# EAGLE schematic class_nrf52840v2_module (EAGLE 9.4.2)
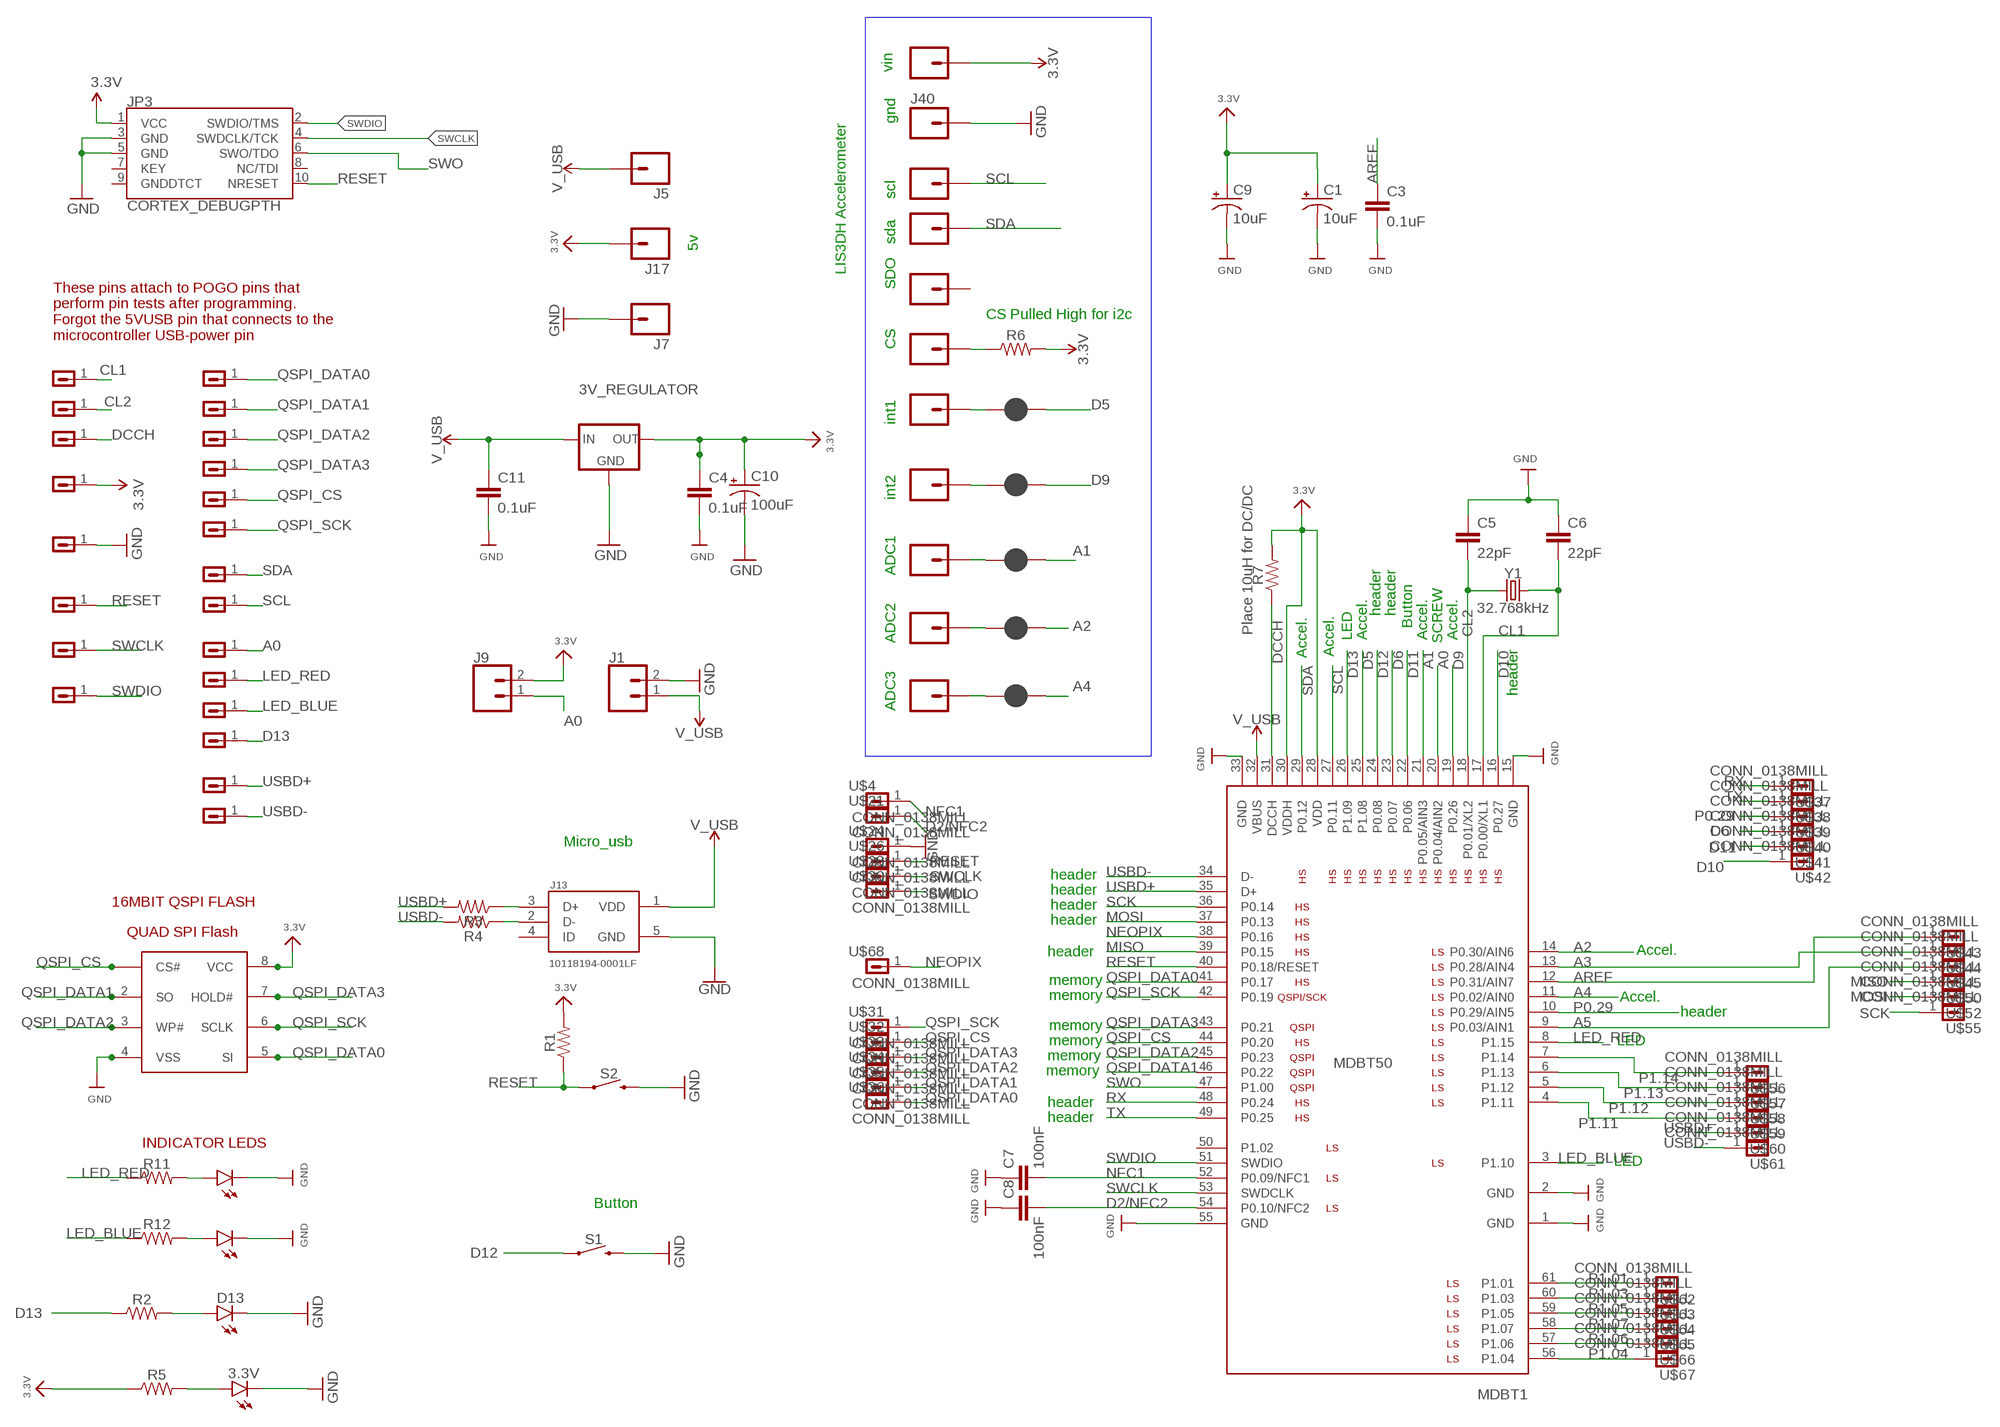
[diagram p0: schematic, sheet 1]

## Parts
3.3V  LED5MM-KIT  [LED5MM-KIT]
3V_REGULATOR  LDL1117_5V_REG  [SOT223]
C1  10uF  10UF-POLAR-RADIAL-2.5MM-KIT-25V-20%  [CPOL-RADIAL-2.5MM-5MM-KIT]
C3  0.1uF  0.1UF-KIT-EZ-50V-20%  [CAP-PTH-SMALL-KIT]
C4  0.1uF  0.1UF-KIT-EZ-50V-20%  [CAP-PTH-SMALL-KIT]
C5  22pF  0.1UF-KIT-EZ-50V-20%  [CAP-PTH-SMALL-KIT]
C6  22pF  0.1UF-KIT-EZ-50V-20%  [CAP-PTH-SMALL-KIT]
C7  100nF  10UF-0805-10V-10%  [0805]
C8  100nF  10UF-0805-10V-10%  [0805]
C9  10uF  10UF-POLAR-RADIAL-2.5MM-KIT-25V-20%  [CPOL-RADIAL-2.5MM-5MM-KIT]
C10  100uF  100UF-POLAR-RADIAL-2.5MM-25V-20%  [CPOL-RADIAL-2.5MM-6.5MM]
C11  0.1uF  0.1UF-KIT-EZ-50V-20%  [CAP-PTH-SMALL-KIT]
D2  LED5MM-KIT  [LED5MM-KIT]
D3  LED5MM-KIT  [LED5MM-KIT]
D13  LED5MM-KIT  [LED5MM-KIT]
J1  CONN_025MM  [SCREWTERMINAL-5MM-2]
J5  M01PTH  [1X01]
J7  M01PTH  [1X01]
J9  CONN_025MM  [SCREWTERMINAL-5MM-2]
J13  10118194-0001LF  [FRAMATOME_10118194-0001LF]
J17  M01PTH  [1X01]
J22  M01PTH  [1X01]
J23  M01PTH  [1X01]
J24  M01PTH  [1X01]
J25  M01PTH  [1X01]
J26  M01PTH  [1X01]
J27  M01PTH  [1X01]
J39  M01PTH  [1X01]
J40  M01PTH  [1X01]
J42  M01PTH  [1X01]
J43  M01PTH  [1X01]
J44  M01PTH  [1X01]
JP1  JUMPER-SMT_2_NC_PASTE_SILK  [SMT-JUMPER_2_NC_PASTE_SILK]
JP2  JUMPER-SMT_2_NC_PASTE_SILK  [SMT-JUMPER_2_NC_PASTE_SILK]
JP3  CORTEX_DEBUGPTH  [2X5-PTH-1.27MM]
JP4  JUMPER-SMT_2_NC_PASTE_SILK  [SMT-JUMPER_2_NC_PASTE_SILK]
JP6  JUMPER-SMT_2_NC_PASTE_SILK  [SMT-JUMPER_2_NC_PASTE_SILK]
JP7  JUMPER-SMT_2_NC_PASTE_SILK  [SMT-JUMPER_2_NC_PASTE_SILK]
MDBT1  MDBT50  [MDBT50]
R1  RESISTORAXIAL-0.3  [AXIAL-0.3]
R2  RESISTORAXIAL-0.3  [AXIAL-0.3]
R3  RESISTORAXIAL-0.3  [AXIAL-0.3]
R4  RESISTORAXIAL-0.3  [AXIAL-0.3]
R5  RESISTORAXIAL-0.3  [AXIAL-0.3]
R6  RESISTORAXIAL-0.3  [AXIAL-0.3]
R7  RESISTORAXIAL-0.3  [AXIAL-0.3]
R11  RESISTORAXIAL-0.3  [AXIAL-0.3]
R12  RESISTORAXIAL-0.3  [AXIAL-0.3]
S1  MOMENTARY-SWITCH-SPST-PTH-12MM  [TACTILE_SWITCH_PTH_12MM]
S2  MOMENTARY-SWITCH-SPST-PTH-12MM  [TACTILE_SWITCH_PTH_12MM]
U$4  CONN_0138MILL  [1X01-40MILL]
U$13  CONN_011.27MM  [1X01-1.27MM]
U$18  CONN_011.27MM  [1X01-1.27MM]
U$19  CONN_011.27MM  [1X01-1.27MM]
U$20  CONN_011.27MM  [1X01-1.27MM]
U$21  CONN_0138MILL  [1X01-40MILL]
U$22  CONN_011.27MM  [1X01-1.27MM]
U$23  CONN_011.27MM  [1X01-1.27MM]
U$24  CONN_0138MILL  [1X01-40MILL]
U$26  CONN_0138MILL  [1X01-40MILL]
U$28  CONN_0138MILL  [1X01-40MILL]
U$29  QUAD_SPI_FLASHSOIC8_300MIL  [SOIC8]
U$30  CONN_0138MILL  [1X01-40MILL]
U$31  CONN_0138MILL  [1X01-40MILL]
U$32  CONN_0138MILL  [1X01-40MILL]
U$33  CONN_0138MILL  [1X01-40MILL]
U$34  CONN_0138MILL  [1X01-40MILL]
U$35  CONN_0138MILL  [1X01-40MILL]
U$36  CONN_0138MILL  [1X01-40MILL]
U$37  CONN_0138MILL  [1X01-40MILL]
U$38  CONN_0138MILL  [1X01-40MILL]
U$39  CONN_0138MILL  [1X01-40MILL]
U$40  CONN_0138MILL  [1X01-40MILL]
U$41  CONN_0138MILL  [1X01-40MILL]
U$42  CONN_0138MILL  [1X01-40MILL]
U$43  CONN_0138MILL  [1X01-40MILL]
U$44  CONN_0138MILL  [1X01-40MILL]
U$45  CONN_0138MILL  [1X01-40MILL]
U$50  CONN_0138MILL  [1X01-40MILL]
U$52  CONN_0138MILL  [1X01-40MILL]
U$55  CONN_0138MILL  [1X01-40MILL]
U$56  CONN_0138MILL  [1X01-40MILL]
U$57  CONN_0138MILL  [1X01-40MILL]
U$58  CONN_0138MILL  [1X01-40MILL]
U$59  CONN_0138MILL  [1X01-40MILL]
U$60  CONN_0138MILL  [1X01-40MILL]
U$61  CONN_0138MILL  [1X01-40MILL]
U$62  CONN_0138MILL  [1X01-40MILL]
U$63  CONN_0138MILL  [1X01-40MILL]
U$64  CONN_0138MILL  [1X01-40MILL]
U$65  CONN_0138MILL  [1X01-40MILL]
U$66  CONN_0138MILL  [1X01-40MILL]
U$67  CONN_0138MILL  [1X01-40MILL]
U$68  CONN_0138MILL  [1X01-40MILL]
U$69  CONN_011.27MM  [1X01-1.27MM]
U$70  CONN_011.27MM  [1X01-1.27MM]
U$71  CONN_011.27MM  [1X01-1.27MM]
U$72  CONN_011.27MM  [1X01-1.27MM]
U$73  CONN_011.27MM  [1X01-1.27MM]
U$74  CONN_011.27MM  [1X01-1.27MM]
U$75  CONN_011.27MM  [1X01-1.27MM]
U$76  CONN_011.27MM  [1X01-1.27MM]
U$77  CONN_011.27MM  [1X01-1.27MM]
U$78  CONN_011.27MM  [1X01-1.27MM]
U$79  CONN_011.27MM  [1X01-1.27MM]
U$80  CONN_011.27MM  [1X01-1.27MM]
U$81  CONN_011.27MM  [1X01-1.27MM]
U$82  CONN_011.27MM  [1X01-1.27MM]
U$83  CONN_011.27MM  [1X01-1.27MM]
U$84  CONN_011.27MM  [1X01-1.27MM]
Y1  32.768kHz  CRYSTAL-32.768KHZPTH-2X6  [CRYSTAL-PTH-2X6-CYL]

## Nets
3.3V [power]: 3V_REGULATOR.2(OUT) 3V_REGULATOR.4(OUT) C1.1(+) C4.1 C9.1(+) C10.1(+) J9.2 J17.1 J22.1 JP3.1(VCC) MDBT1.28(VDD) MDBT1.30(VDDH) R1.P$2 R5.P$1 R6.P$2 R7.P$2 U$18.1 U$29.8(VCC)
A0: J9.1 MDBT1.20(P0.04/AIN2) U$76.1
A1: JP4.2 MDBT1.21(P0.05/AIN3)
A2: JP6.2 MDBT1.14(P0.30/AIN6)
A3: MDBT1.13(P0.28/AIN4) U$44.1
A4: JP7.2 MDBT1.11(P0.02/AIN0)
A5: MDBT1.9(P0.03/AIN1) U$45.1
AREF: C3.1 MDBT1.12(P0.31/AIN7) U$43.1
CL1: C6.2 MDBT1.17(P0.00/XL1) U$82.1 Y1.2
CL2: C5.2 MDBT1.18(P0.01/XL2) U$83.1 Y1.1
D2/NFC2: C8.2 MDBT1.54(P0.10/NFC2) U$21.1
D5: JP1.2 MDBT1.25(P1.08)
D6: MDBT1.23(P0.07) U$40.1
D9: JP2.2 MDBT1.19(P0.26)
D10: MDBT1.16(P0.27) U$42.1
D11: MDBT1.22(P0.06) U$41.1
D12: MDBT1.24(P0.08) S1.1
D13: MDBT1.26(P1.09) R2.P$1 U$79.1
DCCH: MDBT1.31(DCCH) R7.P$1 U$84.1
GND: 3.3V.K(C) 3V_REGULATOR.1(GND) C1.2(-) C3.2 C4.2 C5.1 C6.1 C7.1 C8.1 C9.2(-) C10.2(-) C11.2 D2.K(C) D3.K(C) D13.K(C) J1.2 J7.1 J13.5(GND) J40.1 JP3.3(GND) JP3.5(GND) MDBT1.1(GND) MDBT1.2(GND) MDBT1.15(GND) MDBT1.33(GND) MDBT1.55(GND) S1.3 S2.3 U$13.1 U$24.1 U$29.4(VSS)
LED_BLUE: MDBT1.3(P1.10) R12.P$1 U$78.1
LED_RED: MDBT1.8(P1.15) R11.P$1 U$77.1
MISO: MDBT1.39(P0.15) U$50.1
MOSI: MDBT1.37(P0.13) U$52.1
N$1: D3.A R11.P$2
N$2: J13.3(D+) R3.P$1
N$3: J13.2(D-) R4.P$1
N$4: J25.1 JP4.1
N$8: J24.1 JP6.1
N$10: J27.1 JP7.1
N$14: D2.A R12.P$2
N$19: J26.1 JP2.1
N$27: J44.1 JP1.1
N$28: J23.1 R6.P$1
N$30: 3.3V.A R5.P$2
N$31: D13.A R2.P$2
NEOPIX: MDBT1.38(P0.16) U$68.1
NFC1: C7.2 MDBT1.52(P0.09/NFC1) U$4.1
P0.29: MDBT1.10(P0.29/AIN5) U$39.1
P1.01: MDBT1.61(P1.01) U$62.1
P1.03: MDBT1.60(P1.03) U$63.1
P1.04: MDBT1.56(P1.04) U$67.1
P1.05: MDBT1.59(P1.05) U$64.1
P1.06: MDBT1.57(P1.06) U$66.1
P1.07: MDBT1.58(P1.07) U$65.1
P1.11: MDBT1.4(P1.11) U$59.1
P1.12: MDBT1.5(P1.12) U$58.1
P1.13: MDBT1.6(P1.13) U$57.1
P1.14: MDBT1.7(P1.14) U$56.1
QSPI_CS: MDBT1.44(P0.20) U$29.1(CS#) U$32.1 U$72.1
QSPI_DATA0: MDBT1.41(P0.17) U$23.1 U$29.5(SI) U$36.1
QSPI_DATA1: MDBT1.46(P0.22) U$29.2(SO) U$35.1 U$69.1
QSPI_DATA2: MDBT1.45(P0.23) U$29.3(WP#) U$34.1 U$70.1
QSPI_DATA3: MDBT1.43(P0.21) U$29.7(HOLD#) U$33.1 U$71.1
QSPI_SCK: MDBT1.42(P0.19) U$29.6(SCLK) U$31.1 U$73.1
RESET: JP3.10(NRESET) MDBT1.40(P0.18/RESET) R1.P$1 S2.1 U$20.1 U$26.1
RX: MDBT1.48(P0.24) U$37.1
SCK: MDBT1.36(P0.14) U$55.1
SCL: J43.1 MDBT1.27(P0.11) U$75.1
SDA: J42.1 MDBT1.29(P0.12) U$74.1
SWCLK: JP3.4(SWDCLK/TCK) MDBT1.53(SWDCLK) U$22.1 U$28.1
SWDIO: JP3.2(SWDIO/TMS) MDBT1.51(SWDIO) U$19.1 U$30.1
SWO: JP3.6(SWO/TDO) MDBT1.47(P1.00)
TX: MDBT1.49(P0.25) U$38.1
USBD+: MDBT1.35(D+) R3.P$2 U$60.1 U$80.1
USBD-: MDBT1.34(D-) R4.P$2 U$61.1 U$81.1
V_USB: 3V_REGULATOR.3(IN) C11.1 J1.1 J5.1 J13.1(VDD) MDBT1.32(VBUS)
Unconnected: J13.4(ID) J39.1 JP3.7(KEY) JP3.8(NC/TDI) JP3.9(GNDDTCT) MDBT1.50(P1.02)

## Notes on the sheet
- vin
- LIS3DH Accelerometer | gnd
- scl
- 5v
- sda
- SDO
- CS Pulled High for i2c
- These pins attach to POGO pins that 
  perform pin tests after programming.
  Forgot the 5VUSB pin that connects to the 
  microcontroller USB-power pin
- CS
- int1
- Place 10uH for DC/DC
- int2
- ADC1
- header | header
- Button
- ADC2 | LED | Accel. | Accel. | SCREW | Accel.
- Accel. | Accel.
- header
- ADC3
- Micro_usb
- header
- header
- 16MBIT QSPI FLASH | header
- header
- Accel.
- header
- memory
- Accel.
- memory
- header
- memory
- memory | LED
- memory
- memory
- header
- header
- INDICATOR LEDS
- LED
- Button

## Library data of the parts
3.3V D2 D3 D13 = SparkFun-LED:LED: LEDs Standard schematic elements and footprints for 5mm, 3mm, 1206, and 0603 sized LEDs. 5mm - Spark Fun Electronics SKU : COM-00529 (and others)
3V_REGULATOR = th_libraries_2:LDL1117_5V_REG: STMicroelectronics LDL1117S50R https://www.mouser.com/datasheet/2/389/ldl1117-1156241.pdf Mouser#: 511-LDL1117S50R bought 100 for $18 on ~2/3/18 5V, 1.2amp
C1 C9 = SparkFun-Capacitors:10UF-POLAR: 10.0µF polarized capacitors A capacitor is a passive two-terminal electrical component used to store electrical energy temporarily in an electric field.; PROD_ID: CAP-08440
C3 C4 C11 = SparkFun-Capacitors:0.1UF: 0.1µF ceramic capacitors A capacitor is a passive two-terminal electrical component used to store electrical energy temporarily in an electric field.; PROD_ID: CAP-08370
C5 C6 = SparkFun-Capacitors:0.1UF: 0.1µF ceramic capacitors A capacitor is a passive two-terminal electrical component used to store electrical energy temporarily in an electric field.; PROD_ID: CAP-08370; VALUE: 0.1uF
C7 C8 = SparkFun-Capacitors:10UF: 10.0µF ceramic capacitors A capacitor is a passive two-terminal electrical component used to store electrical energy temporarily in an electric field.; PROD_ID: CAP-11330; VALUE: 10uF
C10 = SparkFun-Capacitors:100UF-POLAR: 100µF polarized capacitors A capacitor is a passive two-terminal electrical component used to store electrical energy temporarily in an electric field.; PROD_ID: CAP-08439
J1 J9 = SparkFun-Connectors:CONN_02: Multi connection point. Often used as Generic Header-pin footprint for 0.1 inch spaced/style header connections On any of the 0.1 inch spaced packages, you can populate with these: Break Away Headers - Straight <https://www.sparkfun.com/products/116> (PRT-00116) Break Away Male Headers - Right Angle <https://www.sparkfun.com/products/553> (PRT-00553) Female Headers <https://www.sparkfun.com/products/115> (PRT-00115) Break Away Headers - Machine Pin <https://www.sparkfun.com/products/117> (PRT-00117) Break Away Female Headers - Swiss Machine Pin <https://www.sparkfun.com/products/743> (PRT-00743) For SCREWTERMINALS and SPRING TERMINALS visit here: Screw Terimnals on SparkFun.com <https://www.sparkfun.com/search/results?term=Screw+Terminals> (5mm/3.5mm/2.54mm spacing) This device is also useful as a general connection point to wire up your design to another part of your project. Our various solder wires solder well into these plated through hole pads. Hook-Up Wire - Assortment (Stranded, 22 AWG) <https://www.sparkfun.com/products/11375> (PRT-11375) Hook-Up Wire - Assortment (Solid Core, 22 AWG) <https://www.sparkfun.com/products/11367> (PRT-11367) View the entire wire category on our website here <https://www.sparkfun.com/categories/141> Special notes: Molex polarized connector foot print use with: PRT-08233 with associated crimp pins and housings. 2.54_SCREWTERM for use with PRT-10571. 3.5mm Screw Terminal footprints for PRT-08084 5mm Screw Terminal footprints for use with PRT-08432; SF_SKU: PRT-08432
J5 J7 J17 J22-J27 J39 J40 J42-J44 = SparkFun-Connectors:M01: Header 1 Standard 1-pin 0.1" header. Use with straight break away headers (SKU : PRT-00116), right angle break away headers (PRT-00553), swiss pins (PRT-00743), machine pins (PRT-00117), and female headers (PRT-00115). SMTSO-256-ET is a "flush mount" nut for a 4-40 screw. The older package used to be too tight, and did not allow it to sit properly thru the drill hit. The latest (0.165DIA) fits nice and snug.
J13 = 10118194-0001LF:10118194-0001LF: Conn Micro USB Type B RCP 5 POS 0.65mm Solder RA SMD 5 Terminal 1 Port T/R; AVAILABILITY: Unavailable; DESCRIPTION: Micro Usb, 2.0 Type b, Rcpt, Smt; MF: Amphenol ICC; MP: 10118194-0001LF; PACKAGE: None; PRICE: None
JP1 JP2 JP4 JP6 JP7 = SparkFun-Jumpers:JUMPER-SMT_2_NC_PASTE: Normally closed solder jumper This jumper has an aperture in the stencil to allow solder paste to bridge the split in the wire so it's normally closed (NC). Wick off the solder to open the connection. Reapply solder to reclose the connection.
JP3 = samd21-temp:CORTEX_DEBUG: Cortex Debug Connector Datasheet <http://infocenter.arm.com/help/topic/com.arm.doc.faqs/attached/13634/cortex_debug_connectors.pdf>
MDBT1 = microbuilder:MDBT50: Raytac Corporation MDBT50 Bluetooth Low Energy Module based on Noridc nRF52840 Source: Raytac datasheet
R1-R7 R11 R12 = SparkFun-Resistors:RESISTOR: Generic Resistor Package
S1 S2 = SparkFun-Switches:MOMENTARY-SWITCH-SPST: Momentary Switch (Pushbutton) - SPST Normally-open (NO) SPST momentary switches (buttons, pushbuttons). Variants PTH-12MM - 12mm square, through-hole Momentary Pushbutton Switch - 12mm Square <https://www.sparkfun.com/products/9190> (COM-09190) PTH-6.0MM, PTH-6.0MM-KIT - 6.0mm square, through-hole Mini Pushbutton Switch <https://www.sparkfun.com/products/97> (COM-00097) KIT package intended for soldering kit's - only one side of pads' copper is exposed. PTH-RIGHT-ANGLE-KIT - Right-angle, through-hole Right Angle Tactile Button <https://www.sparkfun.com/products/10791> - Used on SparkFun BigTime Watch Kit <https://www.sparkfun.com/products/11734> SMD-12MM - 12mm square, surface-mount Tactile Button - SMD (12mm) <https://www.sparkfun.com/products/12993> (COM-12993) Used on SparkFun PicoBoard <https://www.sparkfun.com/products/11888> SMD-4.5MM - 4.5mm Square Trackball Switch Used on SparkFun Blackberry Trackballer Breakout <https://www.sparkfun.com/products/13169> SMD-4.6MMX2.8MM - 4.60mm x 2.80mm, surface mount Used on SparkFun SAMD21 Mini Breakout <https://www.sparkfun.com/products/13664> SMD-5.2MM, SMD-5.2-REDUNDANT - 5.2mm square, surface-mount Mini Pushbutton Switch - SMD <https://www.sparkfun.com/products/8720> (COM-08720) Used on Arduino Pro Mini <https://www.sparkfun.com/products/11114> REDUNDANT package connects both switch circuits together SMD-6.0X3.5MM - 6.0 x 3.5mm, surface mount Momentary Reset Switch SMD <https://www.sparkfun.com/products/8229> (COM-08229) SMD-6.2MM-TALL - 6.2mm square, surface mount Tactile Button - SMD (6mm) <https://www.sparkfun.com/products/12992> Used on SparkFun Digital Sandbox <https://www.sparkfun.com/products/12651> SMD-RIGHT-ANGLE - Right-angle, surface mount Used on SparkFun Block for Intel® Edison - Arduino <https://www.sparkfun.com/products/13036>; PROD_ID: SWCH-09185; SF_SKU: COM-09190
U$4 U$13 U$18-U$24 U$26 U$28 U$30-U$45 U$50 U$52 U$55-U$84 = th_libraries:CONN_01
U$29 = th_libraries3:QUAD_SPI_FLASH: https://www.digikey.com/product-detail/en/gigadevice-semiconductor-hk-limited/GD25Q32CSJGR/1970-1032-1-ND/9484782 16 and 32Mbit flash for circuit python
Y1 = SparkFun-Clocks:CRYSTAL-32.768KHZ: 32.768kHz Crystal Frequency: 32.768kHz Frequency Stability: ±20ppm Load Capacitance: 12.5pF (PTH-2X6 & SMD-3.2X1.5), 6pF (SMD-2X6) SparkFun Products: SparkFun BigTime Watch Kit <https://www.sparkfun.com/products/11734> SparkFun nRF52832 Breakout <https://www.sparkfun.com/products/13990> SparkFun Real Time Clock Module <https://www.sparkfun.com/products/12708>; PROD_ID: XTAL-10112

## Net classes
1 power: width 0.254 mm